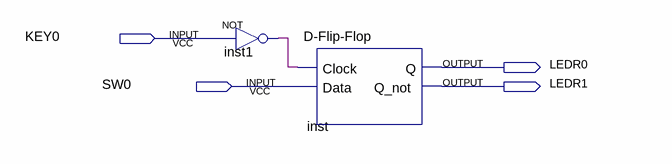
[diagram p0: schematic sheet]
// Quartus schematic Testbench.bdf as structural Verilog: 2 symbols, 4 pins
module Testbench (
  input  KEY0,
  input  SW0,
  output LEDR0,
  output LEDR1
);

  wire inst1_out;

  not inst1 (inst1_out, KEY0);
  \D-Flip-Flop  inst (.Clock(inst1_out), .Data(SW0), .Q(LEDR0), .Q_not(LEDR1));
endmodule
